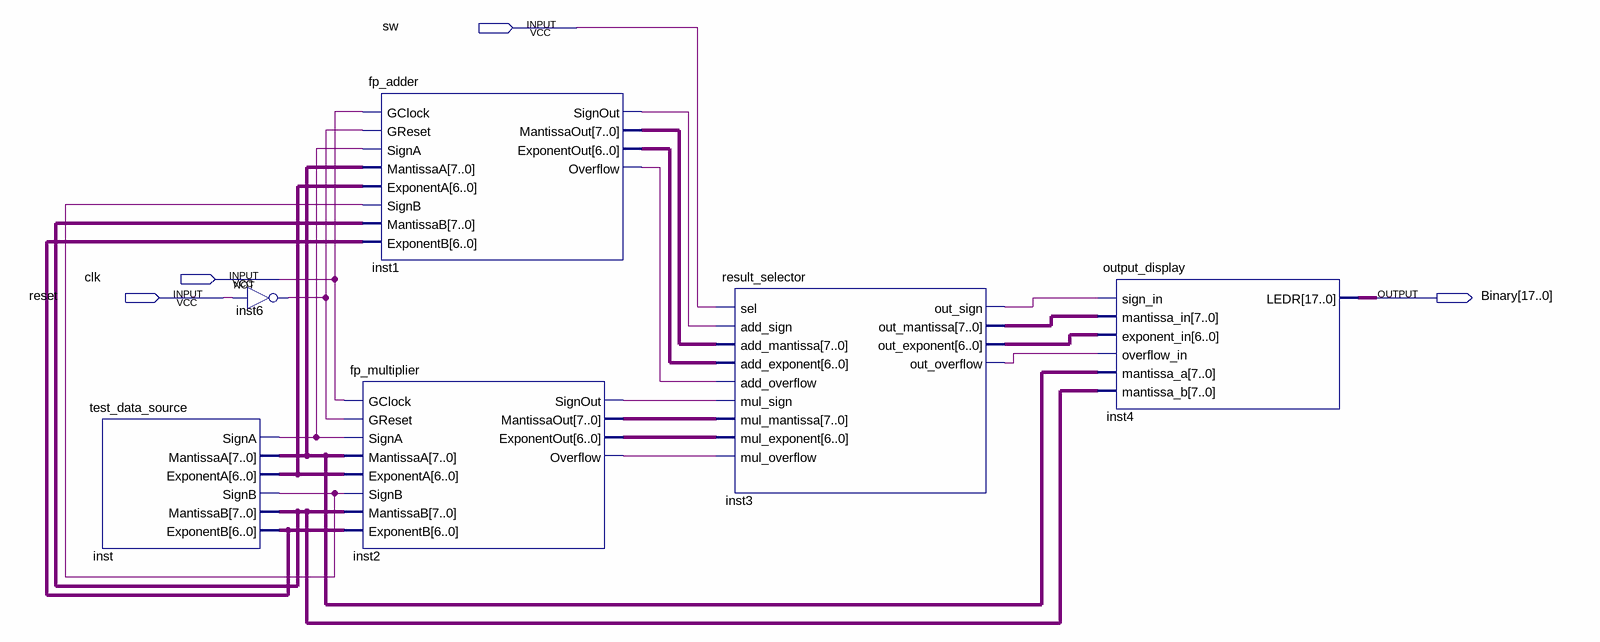
[diagram p0: schematic sheet]
// Quartus schematic top.bdf as structural Verilog: 6 symbols, 4 pins
module top (
  input  sw,
  input  clk,
  input  reset,
  output [17:0] Binary
);

  wire inst1_overflow, inst1_signout, inst2_overflow, inst2_signout, inst3_out_overflow, inst3_out_sign,
       inst6_out, inst_signa, inst_signb;
  wire [6:0] inst1_exponentout, inst2_exponentout, inst3_out_exponent, inst_exponenta, inst_exponentb;
  wire [7:0] inst1_mantissaout, inst2_mantissaout, inst3_out_mantissa, inst_mantissaa, inst_mantissab;

  test_data_source inst (
    .SignA(inst_signa), .MantissaA(inst_mantissaa), .ExponentA(inst_exponenta), .SignB(inst_signb),
    .MantissaB(inst_mantissab), .ExponentB(inst_exponentb));
  not inst6 (inst6_out, reset);
  fp_adder inst1 (
    .GClock(clk), .GReset(inst6_out), .SignA(inst_signa), .MantissaA(inst_mantissaa),
    .ExponentA(inst_exponenta), .SignB(inst_signb), .MantissaB(inst_mantissab), .ExponentB(inst_exponentb),
    .SignOut(inst1_signout), .MantissaOut(inst1_mantissaout), .ExponentOut(inst1_exponentout),
    .Overflow(inst1_overflow));
  fp_multiplier inst2 (
    .GClock(clk), .GReset(inst6_out), .SignA(inst_signa), .MantissaA(inst_mantissaa),
    .ExponentA(inst_exponenta), .SignB(inst_signb), .MantissaB(inst_mantissab), .ExponentB(inst_exponentb),
    .SignOut(inst2_signout), .MantissaOut(inst2_mantissaout), .ExponentOut(inst2_exponentout),
    .Overflow(inst2_overflow));
  result_selector inst3 (
    .sel(sw), .add_sign(inst1_signout), .add_mantissa(inst1_mantissaout), .add_exponent(inst1_exponentout),
    .add_overflow(inst1_overflow), .mul_sign(inst2_signout), .mul_mantissa(inst2_mantissaout),
    .mul_exponent(inst2_exponentout), .mul_overflow(inst2_overflow), .out_sign(inst3_out_sign),
    .out_mantissa(inst3_out_mantissa), .out_exponent(inst3_out_exponent), .out_overflow(inst3_out_overflow));
  output_display inst4 (
    .sign_in(inst3_out_sign), .mantissa_in(inst3_out_mantissa), .exponent_in(inst3_out_exponent),
    .overflow_in(inst3_out_overflow), .mantissa_a(inst_mantissaa), .mantissa_b(inst_mantissab), .LEDR(Binary));
endmodule
